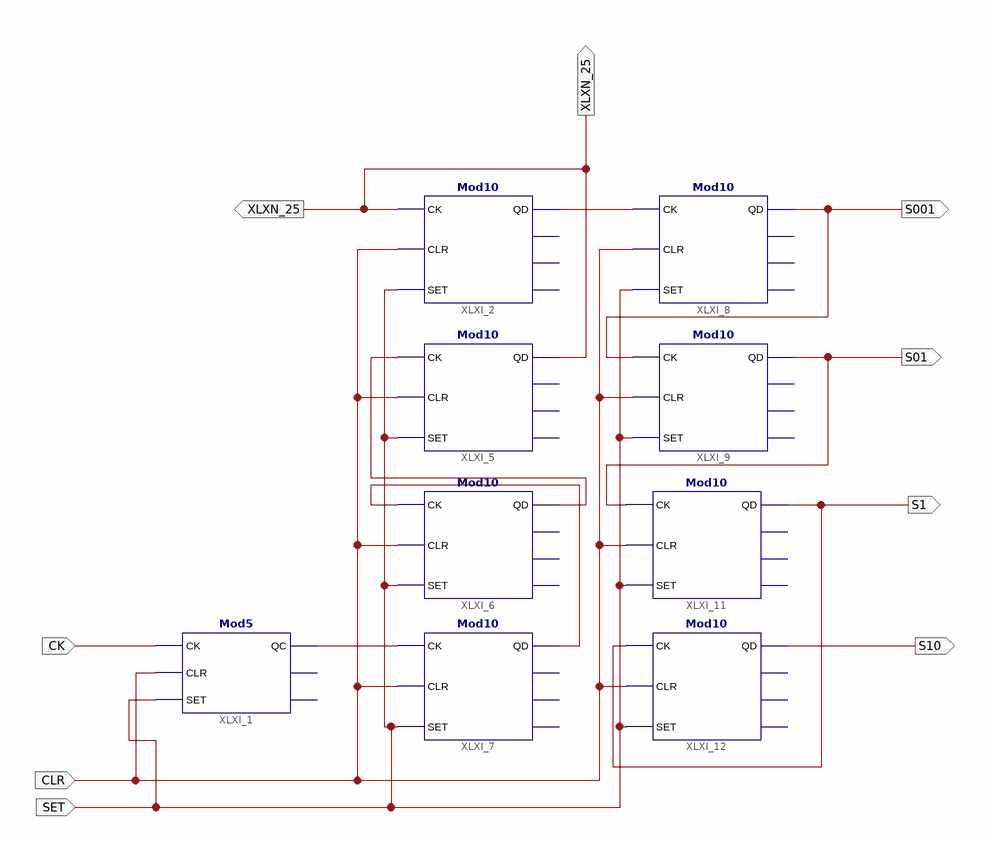
[diagram p0: schematic sheet 1]
// Xilinx ISE schematic OneHz.sch (spartan6) as structural Verilog: 9 symbols, 8 ports
module OneHz (
  input  CK,
  input  CLR,
  input  SET,
  output XLXN_25,
  output S1,
  output S10,
  output S01,
  output S001
);

  wire XLXN_26, XLXN_27, XLXN_34, XLXN_37;

  Mod5 XLXI_1 (.CK(CK), .CLR(CLR), .SET(SET), .QC(XLXN_34));  // open: QB, QA
  Mod10 XLXI_2 (.CK(XLXN_25), .CLR(CLR), .SET(SET), .QD(XLXN_37));  // open: QC, QB, QA
  Mod10 XLXI_5 (.CK(XLXN_26), .CLR(CLR), .SET(SET), .QD(XLXN_25));  // open: QC, QB, QA
  Mod10 XLXI_6 (.CK(XLXN_27), .CLR(CLR), .SET(SET), .QD(XLXN_26));  // open: QC, QB, QA
  Mod10 XLXI_7 (.CK(XLXN_34), .CLR(CLR), .SET(SET), .QD(XLXN_27));  // open: QC, QB, QA
  Mod10 XLXI_8 (.CK(XLXN_37), .CLR(CLR), .SET(SET), .QD(S001));  // open: QC, QB, QA
  Mod10 XLXI_9 (.CK(S001), .CLR(CLR), .SET(SET), .QD(S01));  // open: QC, QB, QA
  Mod10 XLXI_11 (.CK(S01), .CLR(CLR), .SET(SET), .QD(S1));  // open: QC, QB, QA
  Mod10 XLXI_12 (.CK(S1), .CLR(CLR), .SET(SET), .QD(S10));  // open: QC, QB, QA
endmodule
